# EAGLE design v2.6_Schematic (EAGLE 9.4.2)
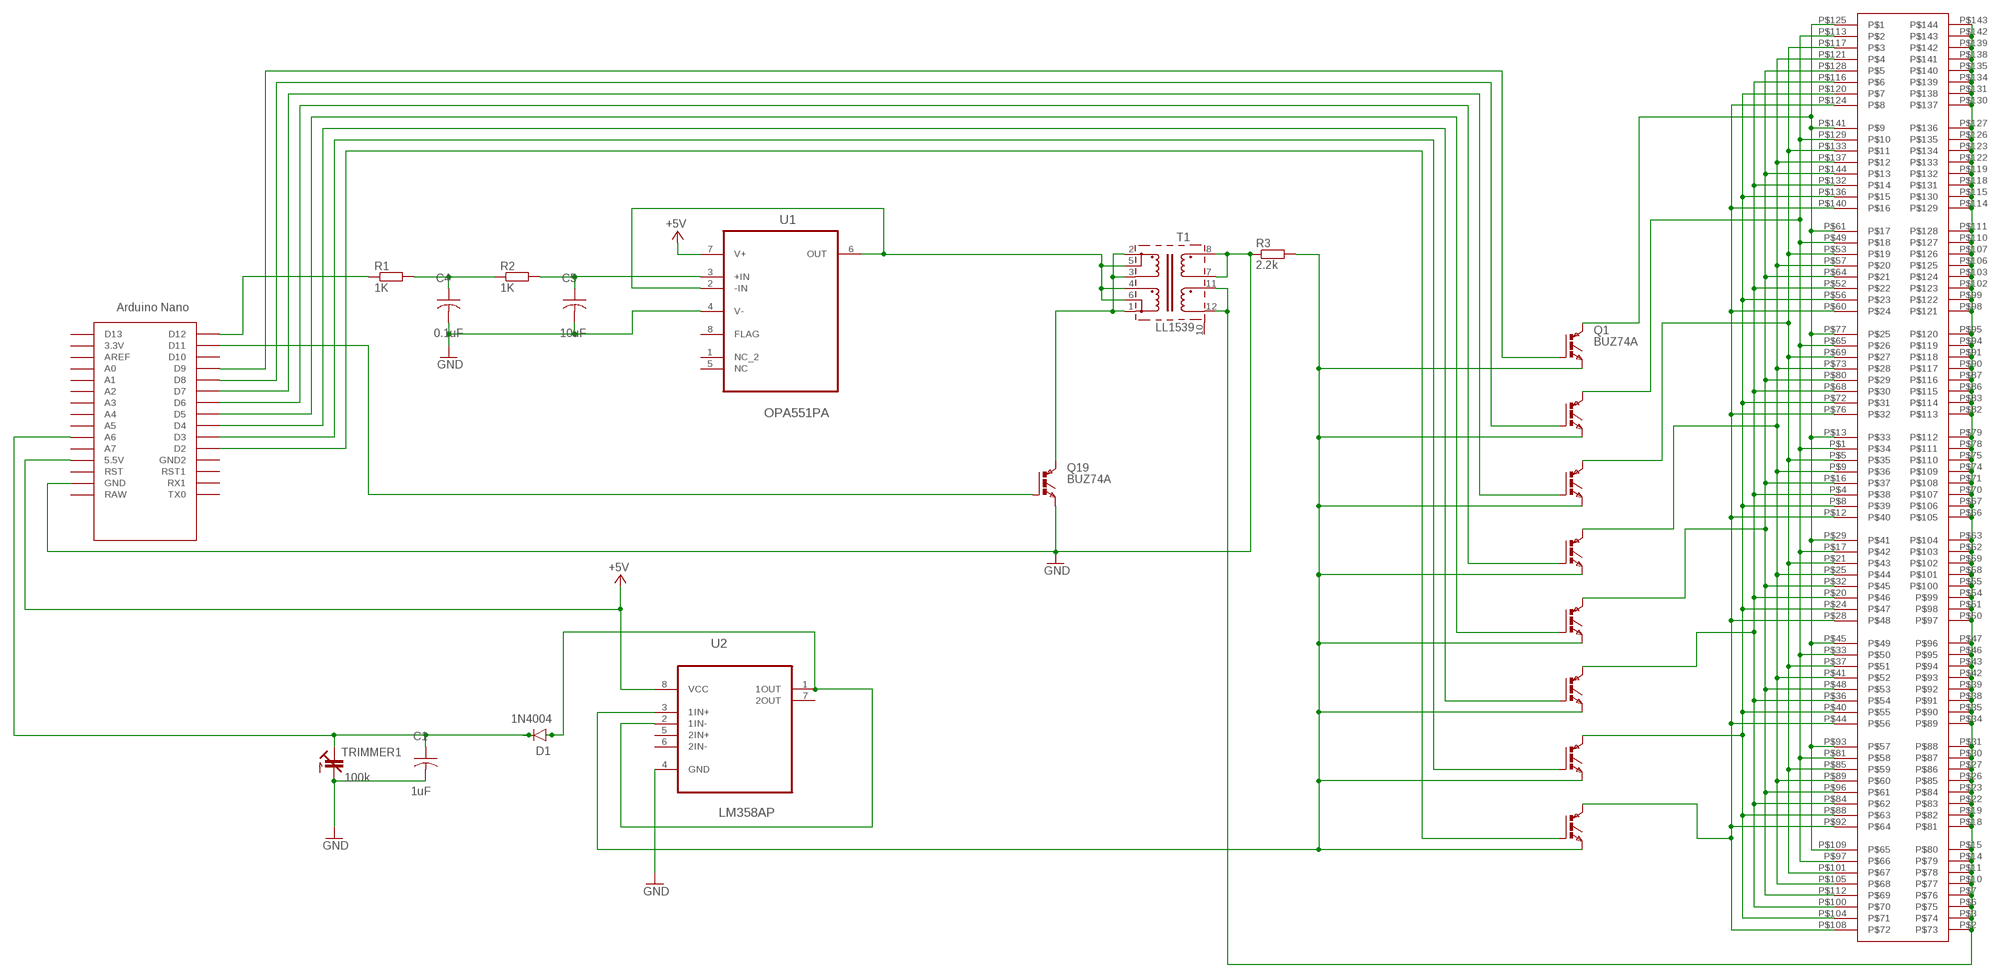
[diagram p0: schematic, sheet 1]

## Parts
C1  1uF  ECA-1HM100  [CAP_RADIAL_2MM]
C4  0.1uF  ECA-1HM100  [CAP_RADIAL_2MM]
C5  10uF  ECA-1HM100  [CAP_RADIAL_2MM]
D1  1N4004  [DO-41]
Q1  BUZ74A  IGBTTO220AV  [TO220AV]
Q2  BUZ74A  IGBTTO220AV  [TO220AV]
Q3  BUZ74A  IGBTTO220AV  [TO220AV]
Q4  BUZ74A  IGBTTO220AV  [TO220AV]
Q5  BUZ74A  IGBTTO220AV  [TO220AV]
Q6  BUZ74A  IGBTTO220AV  [TO220AV]
Q7  BUZ74A  IGBTTO220AV  [TO220AV]
Q8  BUZ74A  IGBTTO220AV  [TO220AV]
Q19  BUZ74A  IGBTTO220AV  [TO220AV]
R1  1K  R-EU_0204/2V  [0204V]
R2  1K  R-EU_0204/2V  [0204V]
R3  2.2k  R-EU_0204/2V  [0204V]
T1  LL1539  [LL1539]
TRIMMER1  100k  C-TRIMM3040.452  [CTRIM3040.452]
U1  OPA551PA  [DIP254P762X508-8]
U2  LM358AP  [DIP254P762X508-8]
U$1  NANO  [NANO]
U$2  DOTS_V2  [DOTS_V2]

## Nets
+5V: U1.7(V+) U2.8(VCC) U$1.5V(5.5V)
GND: C1.2 C4.2 C5.2 Q19.E R3.1 T1.7 T1.8 TRIMMER1.2(A) U1.4(V-) U2.4(GND) U$1.GND
N$1: T1.11 T1.12 U$2.P$2 U$2.P$3 U$2.P$6 U$2.P$7 U$2.P$10 U$2.P$11 U$2.P$14 U$2.P$15 U$2.P$18 U$2.P$19 U$2.P$22 U$2.P$23 U$2.P$26 U$2.P$27 U$2.P$30 U$2.P$31 U$2.P$34 U$2.P$35 U$2.P$38 U$2.P$39 U$2.P$42 U$2.P$43 U$2.P$46 U$2.P$47 U$2.P$50 U$2.P$51 U$2.P$54 U$2.P$55 U$2.P$58 U$2.P$59 U$2.P$62 U$2.P$63 U$2.P$66 U$2.P$67 U$2.P$70 U$2.P$71 U$2.P$74 U$2.P$75 U$2.P$78 U$2.P$79 U$2.P$82 U$2.P$83 U$2.P$86 U$2.P$87 U$2.P$90 U$2.P$91 U$2.P$94 U$2.P$95 U$2.P$98 U$2.P$99 U$2.P$102 U$2.P$103 U$2.P$106 U$2.P$107 U$2.P$110 U$2.P$111 U$2.P$114 U$2.P$115 U$2.P$118 U$2.P$119 U$2.P$122 U$2.P$123 U$2.P$126 U$2.P$127 U$2.P$130 U$2.P$131 U$2.P$134 U$2.P$135 U$2.P$138 U$2.P$139 U$2.P$142 U$2.P$143
N$2: C4.1 R1.2 R2.1
N$3: C5.1 R2.2 U1.3(+IN)
N$4: T1.4 T1.5 T1.6 U1.2(-IN) U1.6(OUT)
N$5: Q19.C T1.1 T1.2 T1.3
N$6: Q19.G U$1.D11
N$7: D1.A U2.1(1OUT) U2.2(1IN-)
N$8: C1.1 D1.C TRIMMER1.1A(E) U$1.A6
N$9: Q8.G U$1.D2
N$10: Q7.G U$1.D3
N$11: Q2.G U$1.D8
N$12: Q6.G U$1.D4
N$13: R1.1 U$1.D12
N$14: Q5.G U$1.D5
N$15: Q4.G U$1.D6
N$16: Q3.G U$1.D7
N$17: Q1.E Q2.E Q3.E Q4.E Q5.E Q6.E Q7.E Q8.E R3.2 U2.3(1IN+)
N$19: Q4.C U$2.P$9 U$2.P$25 U$2.P$41 U$2.P$57 U$2.P$73 U$2.P$89 U$2.P$105 U$2.P$121 U$2.P$137
N$20: Q1.G U$1.D9
N$21: Q2.C U$2.P$1 U$2.P$17 U$2.P$33 U$2.P$49 U$2.P$65 U$2.P$81 U$2.P$97 U$2.P$113 U$2.P$129
N$22: Q3.C U$2.P$5 U$2.P$21 U$2.P$37 U$2.P$53 U$2.P$69 U$2.P$85 U$2.P$101 U$2.P$117 U$2.P$133
N$23: Q5.C U$2.P$16 U$2.P$32 U$2.P$48 U$2.P$64 U$2.P$80 U$2.P$96 U$2.P$112 U$2.P$128 U$2.P$144
N$24: Q6.C U$2.P$4 U$2.P$20 U$2.P$36 U$2.P$52 U$2.P$68 U$2.P$84 U$2.P$100 U$2.P$116 U$2.P$132
N$25: Q7.C U$2.P$8 U$2.P$24 U$2.P$40 U$2.P$56 U$2.P$72 U$2.P$88 U$2.P$104 U$2.P$120 U$2.P$136
N$26: Q8.C U$2.P$12 U$2.P$28 U$2.P$44 U$2.P$60 U$2.P$76 U$2.P$92 U$2.P$108 U$2.P$124 U$2.P$140
N$28: Q1.C U$2.P$13 U$2.P$29 U$2.P$45 U$2.P$61 U$2.P$77 U$2.P$93 U$2.P$109 U$2.P$125 U$2.P$141
Unconnected: T1.10 U1.1(NC_2) U1.5(NC) U1.8(FLAG) U2.5(2IN+) U2.6(2IN-) U2.7(2OUT) U$1.3.3V U$1.A0 U$1.A1 U$1.A2 U$1.A3 U$1.A4 U$1.A5 U$1.A7 U$1.AREF U$1.D10 U$1.D13 U$1.GND1(GND2) U$1.RAW U$1.RST U$1.RST1 U$1.RX1 U$1.TX0

## Library data of the parts
C1 C4 C5 = Resistor_Capacitor:ECA-1HM100: CAP ALUM 10UF 20% 50V RADIAL Manufacturer's datasheet <https://media.digikey.com/pdf/Data%20Sheets/Panasonic%20Electronic%20Components/ECA-xxM%20Series,TypeA.pdf>; CREATED_BY: PCBLayout.com; DIGIKEY_PART_NUMBER: P5178-ND; MANUFACTURER: Panasonic Electronic Components; MPN: ECA-1HM100; PACKAGE: CAP RADIAL 2MM LS
D1 = Diodes:1N4004: DIODE GEN PURP 400V 1A DO41 Manufacturer's datasheet <https://www.mccsemi.com/pdf/Products/1N4001-1N4007(DO-41).pdf>; CREATED_BY: PCBLayout.com; DIGIKEY_PART_NUMBER: 1N4004MSCT-ND; MANUFACTURER: Micro Commercial Co; MPN: 1N4004; PACKAGE: DO-41
Q1-Q8 Q19 = IGBT:IGBT: IGBT
R1-R3 = resistor:R-EU_: RESISTOR, European symbol
T1 = lundahl:LL1539: LL1539 Transformer
TRIMMER1 = resistor:C-TRIMM: Trimm capacitor
U1 = Texas Instruments_By_element14_Batch_1:OPA551PA: OPERATIONAL AMPLIFIER; MPN: OPA551PA; OC_FARNELL: 4427191; OC_NEWARK: 75C5068; PACKAGE: PDIP; SUPPLIER: Texas Instruments
U2 = Texas Instruments_By_element14_Batch_1:LM358AP: OPERATIONAL AMPLIFIER; MPN: LM358AP; OC_FARNELL: 1459520; OC_NEWARK: 67K0318; PACKAGE: PDIP; SUPPLIER: Texas Instruments
U$1 = Arduino-clone:NANO: Arduino Nano
U$2 = Library:DOTS_V2

## Board
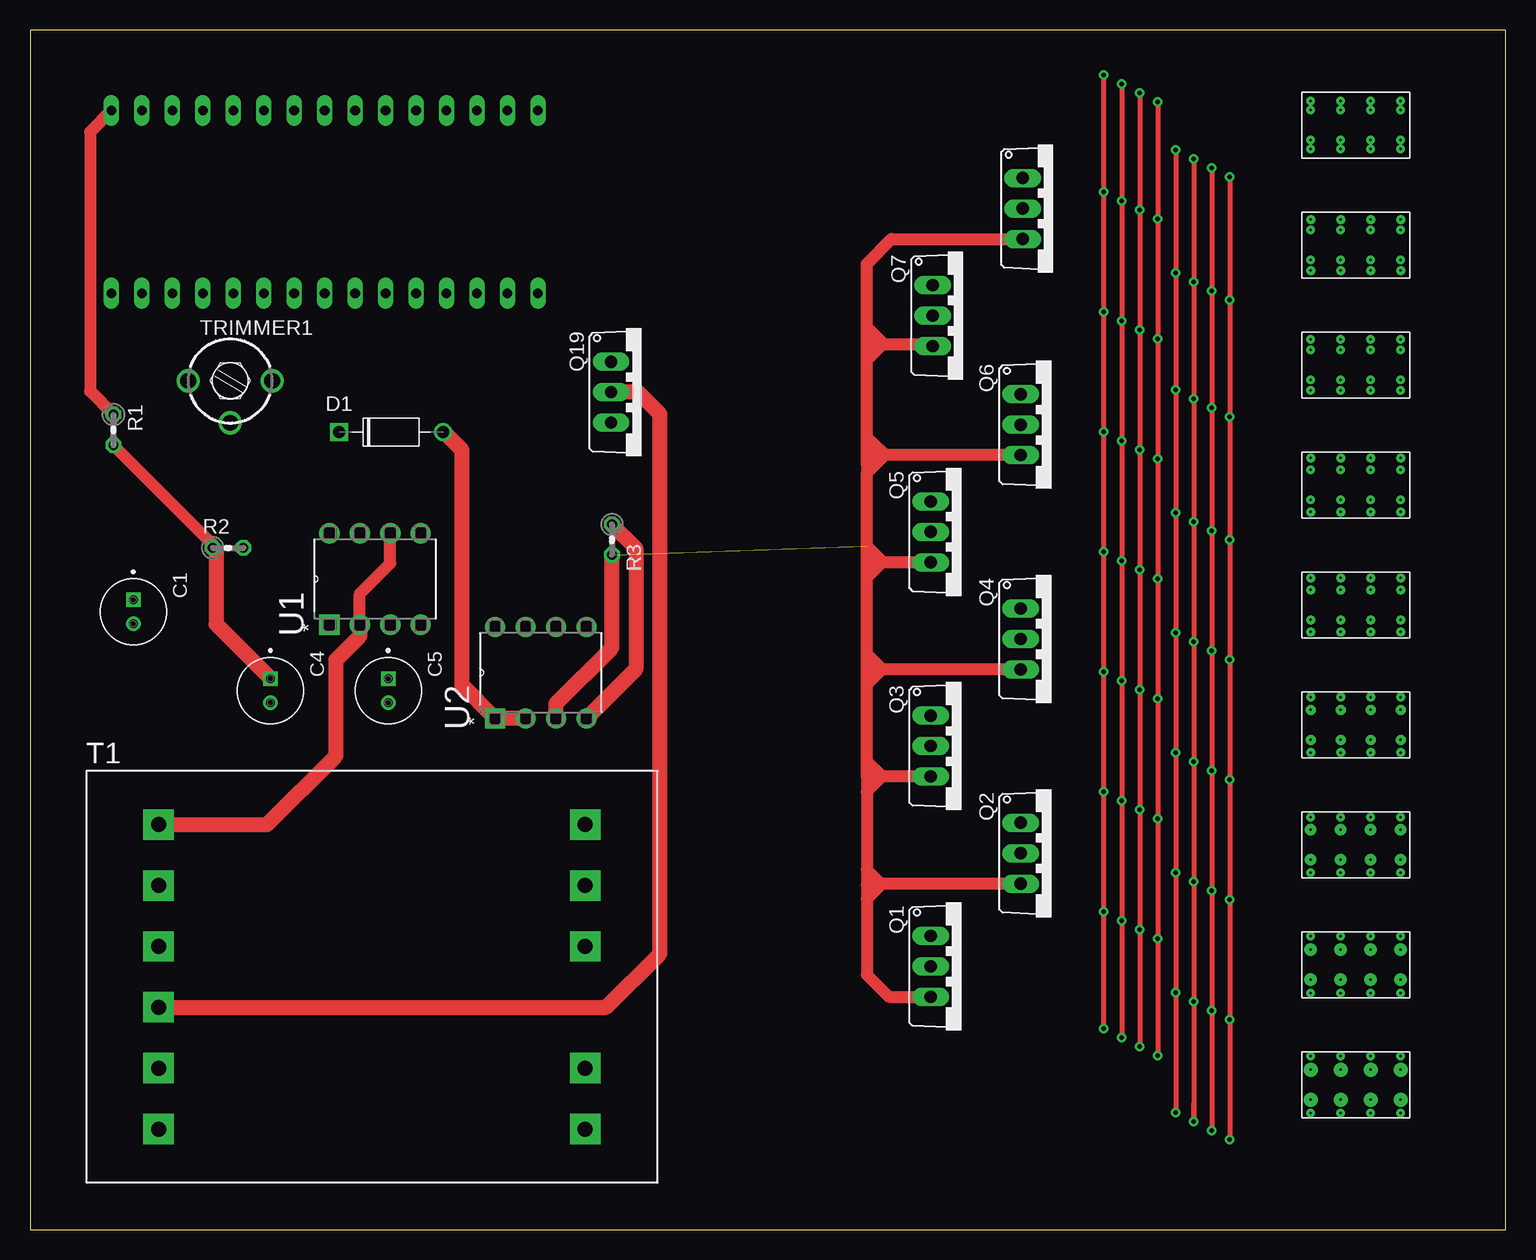
[diagram p1: board, top side]
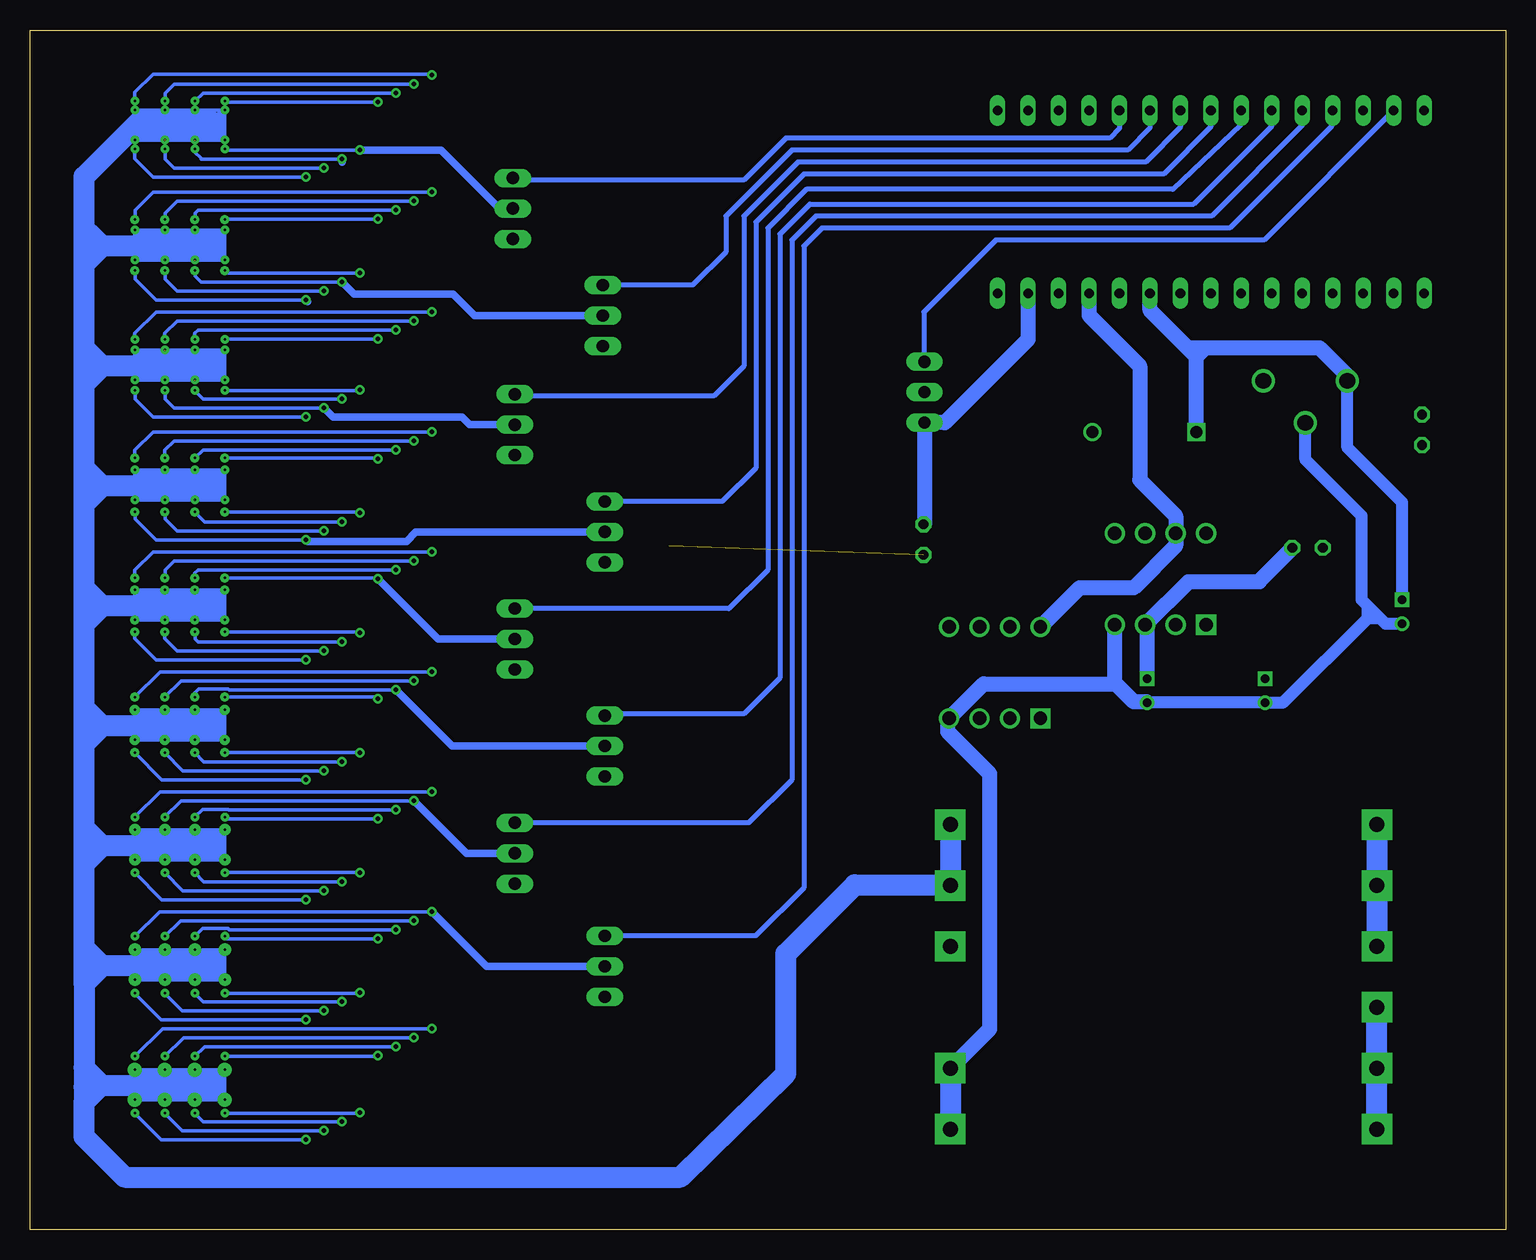
[diagram p2: board, bottom side, seen from below]

Size 123 x 100 mm. Coordinates in mm from the lower left corner, seen from the top.
Outline: 0,0 123,0 123,100 0,100 0,0
Copper layers (1*16): Top 0.035mm / dielectric 1.5mm / Bottom 0.035mm
Design rules "default": minimum track width 6mil, minimum drill 0.35mm, track to track 6mil, track to pad 6mil, pad to pad 6mil, via to via 6mil, smd to smd 6mil, copper to edge 40mil, drill to drill 6mil, minimum pad ring 10mil, minimum via ring 8mil, stop-mask expansion 4mil, vias tented up to drill 0mil, thermal gap 10mil

### Footprints (pad centres in the part's own frame; a part is rotated, then mirrored left to right if it is on the bottom)
CAP_RADIAL_2MM = drill 0.7 pad 1.1 square: 1 -1,0 | drill 0.7 pad 1.1: 2 1,0
DO-41 = drill 1: A 4.325,0 | drill 1 square: C -4.325,0
TO220AV = drill 1.016 long: C 0,-2.54; E 2.54,-2.54; G -2.54,-2.54
0204V = drill 0.813 octagon: 1 -1.27,0; 2 1.27,0
LL1539 = drill 1.27 pad 2.54 square: 1 -17.78,-12.7; 2 -17.78,-7.62; 3 -17.78,-2.54; 4 -17.78,2.54; 5 -17.78,7.62; 6 -17.78,12.7; 7 17.78,-12.7; 8 17.78,-7.62; 10 17.78,2.54; 11 17.78,7.62; 12 17.78,12.7
CTRIM3040.452 = drill 1.3: 1A -3.5,0; 1B 3.5,0; 2 0,-3.5
DIP254P762X508-8 = drill 1.118 square: 1 -7.62,7.62 | drill 1.118: 2 -7.62,5.08; 3 -7.62,2.54; 4 -7.62,0; 5 0,0; 6 0,2.54; 7 0,5.08; 8 0,7.62
NANO = drill 0.8 long: 3.3V -10.16,24.13; 5V -10.16,-1.27; A0 -10.16,19.05; A1 -10.16,16.51; A2 -10.16,13.97; A3 -10.16,11.43; A4 -10.16,8.89; A5 -10.16,6.35; A6 -10.16,3.81; A7 -10.16,1.27; AREF -10.16,21.59; D2 5.08,1.27; D3 5.08,3.81; D4 5.08,6.35; D5 5.08,8.89; D6 5.08,11.43; D7 5.08,13.97; D8 5.08,16.51; D9 5.08,19.05; D10 5.08,21.59; D11 5.08,24.13; D12 5.08,26.67; D13 -10.16,26.67; GND -10.16,-6.35; GND1 5.08,-1.27; RAW -10.16,-8.89; RST -10.16,-3.81; RST1 5.08,-3.81; RX1 5.08,-6.35; TX0 5.08,-8.89
DOTS_V2 = drill 0.2 pad 0.75: P$1 -2.25,1.25; P$2 -1.25,1.25; P$3 1.25,1.25; P$4 2.25,1.25; P$5 -2.25,-1.25; P$6 -1.25,-1.25; P$7 1.25,-1.25; P$8 2.25,-1.25; P$9 -2.25,-3.75; P$10 -1.25,-3.75; P$11 1.25,-3.75; P$12 2.25,-3.75; P$13 -2.25,3.75; P$14 -1.25,3.75; P$15 1.25,3.75; P$16 2.25,3.75; P$17 7.688,1.25; P$20 12.312,1.25; P$21 7.688,-1.25; P$24 12.312,-1.25; P$25 7.688,-3.75; P$28 12.312,-3.75; P$29 7.688,3.75; P$32 12.312,3.75; P$65 -12.25,1.25; P$68 -7.75,1.25; P$69 -12.25,-1.25; P$72 -7.75,-1.25; P$73 -12.25,-3.75; P$76 -7.75,-3.75; P$77 -12.25,3.75; P$80 -7.75,3.75; P$129 -32.125,1.25; P$132 -27.875,1.25; P$133 -32.125,-1.25; P$136 -27.875,-1.25; P$137 -32.125,-3.75; P$140 -27.875,-3.75; P$141 -32.125,3.75; P$144 -27.875,3.75 | drill 0.2 pad 0.85: P$18 8.75,1.25; P$19 11.25,1.25; P$22 8.75,-1.25; P$23 11.25,-1.25; P$26 8.75,-3.75; P$27 11.25,-3.75; P$30 8.75,3.75; P$31 11.25,3.75 | drill 0.2 pad 0.65: P$33 17.688,1.25; P$36 22.312,1.25; P$37 17.688,-1.25; P$40 22.312,-1.25; P$41 17.688,-3.75; P$44 22.312,-3.75; P$45 17.688,3.75; P$48 22.312,3.75; P$66 -11.25,1.25; P$67 -8.75,1.25; P$70 -11.25,-1.25; P$71 -8.75,-1.25; P$74 -11.25,-3.75; P$75 -8.75,-3.75; P$78 -11.25,3.75; P$79 -8.75,3.75; P$113 -42,1.25; P$116 -38,1.25; P$117 -42,-1.25; P$120 -38,-1.25; P$121 -42,-3.75; P$124 -38,-3.75; P$125 -42,3.75; P$128 -38,3.75 | drill 0.2 pad 0.95: P$34 18.75,1.25; P$35 21.25,1.25; P$38 18.75,-1.25; P$39 21.25,-1.25; P$42 18.75,-3.75; P$43 21.25,-3.75; P$46 18.75,3.75; P$47 21.25,3.75 | drill 0.2 pad 0.7: P$49 -22.125,1.25; P$52 -17.875,1.25; P$53 -22.125,-1.25; P$56 -17.875,-1.25; P$57 -22.125,-3.75; P$60 -17.875,-3.75; P$61 -22.125,3.75; P$64 -17.875,3.75 | drill 0.2 pad 0.55: P$50 -21.25,1.25; P$51 -18.75,1.25; P$54 -21.25,-1.25; P$55 -18.75,-1.25; P$58 -21.25,-3.75; P$59 -18.75,-3.75; P$62 -21.25,3.75; P$63 -18.75,3.75; P$97 37.625,1.25; P$100 42.375,1.25; P$101 37.625,-1.25; P$104 42.375,-1.25; P$105 37.625,-3.75; P$108 42.375,-3.75; P$109 37.625,3.75; P$112 42.375,3.75 | drill 0.2 pad 0.6: P$81 27.625,1.25; P$84 32.375,1.25; P$85 27.625,-1.25; P$88 32.375,-1.25; P$89 27.625,-3.75; P$92 32.375,-3.75; P$93 27.625,3.75; P$96 32.375,3.75 | drill 0.2 pad 1.05: P$82 28.75,1.25; P$83 31.25,1.25; P$86 28.75,-1.25; P$87 31.25,-1.25; P$90 28.75,-3.75; P$91 31.25,-3.75; P$94 28.75,3.75; P$95 31.25,3.75 | drill 0.2 pad 1.15: P$98 38.75,1.25; P$99 41.25,1.25; P$102 38.75,-1.25; P$103 41.25,-1.25; P$106 38.75,-3.75; P$107 41.25,-3.75; P$110 38.75,3.75; P$111 41.25,3.75 | drill 0.2 pad 0.35: P$114 -41.25,1.25; P$115 -38.75,1.25; P$118 -41.25,-1.25; P$119 -38.75,-1.25; P$122 -41.25,-3.75; P$123 -38.75,-3.75; P$126 -41.25,3.75; P$127 -38.75,3.75 | drill 0.2 pad 0.45: P$130 -31.25,1.25; P$131 -28.75,1.25; P$134 -31.25,-1.25; P$135 -28.75,-1.25; P$138 -31.25,-3.75; P$139 -28.75,-3.75; P$142 -31.25,3.75; P$143 -28.75,3.75

### Placement (x,y rotation side)
C1  8.61,51.5 270 top
C4  20.05,44.93 270 top
C5  29.86,44.92 270 top
D1  30.1,66.47 0 top
Q1  77.63,21.94 270 top
Q2  85.13,31.37 270 top
Q3  77.63,40.3 270 top
Q4  85.13,49.23 270 top
Q5  77.63,58.16 270 top
Q6  85.13,67.09 270 top
Q7  77.79,76.19 270 top
Q8  85.29,85.12 270 top
Q19  50.98,69.8 270 top
R1  6.95,66.67 270 top
R2  16.51,56.83 0 top
R3  48.52,57.51 270 top
T1  28.5,21.07 0 top
TRIMMER1  16.69,70.75 0 top
U1  32.58,58.04 90 top
U2  46.39,50.23 90 top
U$1  33.45,88.22 90 top
U$2  110.51,52.07 270 top

### Tracks (layer width: path | path; a pad name or v marks a point on that pad's centre or on a via)
+5V
  Bottom 1.27: U2.8 35.5,53.5 31,53.5 27.5,57 U1.7 27.5,59.5 30.5,62.5 30.5,72 34.72,76.22 U$1.5V
GND
  Top 1.27: R3.1 50.5,56.8 50.5,46.73 U2.4
  Bottom 1.016: C1.2 10,50.5 10.5,51 | 10.5,51 11,51.5 | 11,51.5 11.5,52 | 11.5,52 12,52.5 12,59.5 16.69,64.19 TRIMMER1.2 | 11.5,51 18.57,43.93 C4.2 C5.2 | 11.5,51 11,51.5 | 11.5,51 10.5,51 | 11.5,51 11.5,52
  Bottom 1.27: U$1.GND 39.81,74.19 46.74,67.26 Q19.E 48.44,58.86 R3.1 | C5.2 29.94,44 31,44 32.58,45.58 | 32.58,45.58 U1.4 | 32.58,45.58 32.66,45.5 43.5,45.5 U2.4 46.5,42.51 46.5,41.5 43,38 43,16.73 T1.8
  Bottom 1.75: T1.8 T1.7
N$1  (7 unrouted)
  Bottom 0.152: U$2.P$22 U$2.P$18 | U$2.P$31 U$2.P$19 U$2.P$23 U$2.P$27 | U$2.P$15 U$2.P$3 U$2.P$7 U$2.P$11 | U$2.P$6 U$2.P$2 113.5,53.32 | 107.5,63.32 U$2.P$70 U$2.P$66 | U$2.P$71 U$2.P$67 U$2.P$79 | 114,70.82 U$2.P$63 | 107.5,83.32 U$2.P$134 U$2.P$130 113.25,83.32 | 114,90.82 U$2.P$127
  Bottom 0.305: 106.76,92 U$2.P$122 U$2.P$126 114.26,92 | 106.76,92 106.76,90.88 U$2.P$123 U$2.P$119 U$2.P$115 114,90.82 | 106.76,82.5 U$2.P$138 107.5,83.32 | 106.76,82.5 106.76,82 | 106.76,82 U$2.P$139 U$2.P$135 U$2.P$131 U$2.P$143 114.26,82 | 113.5,83.32 U$2.P$142 114.26,82.56 | 113.5,83.32 113.25,83.32 | 113.25,83.32 107.5,83.32 | 114,70.82 U$2.P$55 U$2.P$59 106.76,72 | 106.76,72 106.76,72.5 | 106.76,72.5 U$2.P$58 107.58,73.32 | 114.26,92 U$2.P$127 | 114.26,72.81 U$2.P$62 113.75,73.32 | 114.26,72 114.26,72.5 | 114.26,72 U$2.P$63 | 113.75,73.32 113.5,73.32 | 113.5,73.32 U$2.P$50 107.58,73.32 | 106.76,62 106.76,63.25 U$2.P$74 107.5,63.32 | 106.76,62 U$2.P$75 U$2.P$71 U$2.P$79 114.26,62 | 113.75,63.32 U$2.P$78 114.26,62.75 | 113.75,63.32 113.5,63.32 | 113.5,63.32 U$2.P$66 107.5,63.32 | 114.26,62.75 114.26,62 | 106.76,52.75 U$2.P$10 107.5,53.32 | 106.76,52.75 106.76,52.5 | 106.76,52.5 106.76,52 | 106.76,52 U$2.P$11 U$2.P$3 U$2.P$15 114.26,52 | 113.75,53.32 U$2.P$14 114.26,52 | 113.75,53.32 113.5,53.32 | 113.5,53.32 U$2.P$6 107.5,53.32 | 106.76,42.75 U$2.P$26 107.5,43.32 | 106.76,42.75 106.76,42 | 106.76,42 U$2.P$27 U$2.P$31 114.26,42 | 107.5,43.32 U$2.P$22 U$2.P$18 113.5,43.32 | 113.5,43.32 113.75,43.32 | 113.75,43.32 U$2.P$30 114.26,42.75 | 114.26,42.75 114.26,42 | 106.76,32 U$2.P$42 U$2.P$34 U$2.P$46 114.26,32 | 106.76,32 U$2.P$43 U$2.P$47 114.26,32 | 114.26,22 U$2.P$94 U$2.P$90 106.76,22 | 114.26,22 U$2.P$95 U$2.P$91 106.76,22 | U$2.P$106 106.76,12 | 106.76,11.5 U$2.P$107 107,10.82 | 106.76,11.5 106.76,12 | 107,10.82 107.43,10.82 | 107.43,10.82 113.5,10.82 | U$2.P$111 114.26,11.5 | 114.26,11.5 114.26,12 | 114.26,12 114.26,12.5 | 114.26,12.5 114.26,12.75
  Bottom 0.305: 114.26,12.75 U$2.P$110 | 107.68,13.32 113.44,13.32 | 113.69,13.32 U$2.P$110 | 106.76,12 107,12 | 107,12 108,12 107.5,11.5 107.12,11.12 | 106.76,22 107,22 108,22 | 113,22 114,22 114.26,22 | 106.76,32 108,32 | 113,32 113.25,32 114.26,32 | 106.76,42 108,42 | 113.51,42 114.26,42 | 106.76,52 107.5,52 107.51,52 | 114,52 113.5,52 113,52 113.5,52.5 | 114,52 114.26,52 | 106.76,62 107.25,62 107.5,62 108,62 | 114.26,62 114,62 113.5,62 113,62 113.5,62.5 | 106.76,72 107.5,72 108,72 | 113.76,72 114.26,72 | 106.76,82 108,82 | 114.26,82 113,82 113.25,82.25 113.25,83.32 | 106.76,92 108,92 | 113,92 114.26,92 | U$2.P$106 107,13.08 107,12 | 107.68,13.32 108,13 107.57,13 | U$2.P$106 107,13.32 | 107,13.32 107.25,13.32 | 107.25,13.32 107.68,13.32 | U$2.P$106 107.08,13 107.32,13 | 107.57,13 107.25,13.32 | 107.57,13 107.32,13 | 107.32,13 107,13.32 | 107.12,11.12 107,11 | 107,11 107,10.82 | 106.76,11.5 107,11.26 107,11 | 107.43,10.82 107.12,11.12 | 113.44,13.32 113.69,13.32 | 113.69,13.32 114,13.01 | 114,13.01 114.26,12.75 | 113.44,13.32 114.26,12.5 | U$2.P$110 114.26,13.26 114,13.01 | 113,12 113.88,12 114.26,12 | 113.5,10.82 113.72,11.04 | 113.72,11.04 113.97,11.29 | 113.97,11.29 114.18,11.5 114.26,11.5 | U$2.P$111 113.97,11.12 113.97,11.29 | U$2.P$111 113.5,10.82 | U$2.P$111 113.93,10.82 113.72,11.04 | 113.5,42.5 113.5,43.32 | 113.75,43.32 113.75,42.75 113,42 113.51,42 | 113.51,42 114.26,42.75 | 107.5,42.58 106.93,42.58 106.76,42.75 | 107.16,42.91 107.16,42.98 107.5,43.32 | 107.5,53.32 107.5,52.5 108,52 107.51,52 | 107.29,52.79 107,52.5 106.76,52.5 | 107.51,52 106.76,52.75 | 113.75,52.75 113.84,52.84 113.84,52.91 114,52.75 114,52 | 113.5,52.5 113.5,53.32 | 113.5,52.5 113.75,52.75
  Bottom 0.305: 113.75,52.75 113.75,53.32 | 107.5,62.75 107.5,63.32 | 113.69,62.75 113.5,62.94 | 113.5,62.94 113.5,63.32 | 113.72,62.78 114.23,62.78 114.26,62.75 | 113.5,62.5 113.5,62.94 | 113.5,62.5 113.75,62.75 113.75,63.32 | 106.76,72.5 107.58,73.32 | 113.5,72.5 113,72 113.51,72 | 113.5,72.5 113.5,73.32 | 114.26,72.5 114.26,72.75 | 114.26,72.75 114.26,72.81 | 114.26,72.81 113.78,73.28 | 113.78,73.28 113.75,73.32 | 113.51,72 113.76,72 | 113.76,72 114.26,72.5 | 113.51,72 114.26,72.75 | 113.5,72.5 113.78,72.78 113.78,73.28 | 106.76,82.5 107.5,83.24 107.5,83.32 | 114.26,82 114.26,82.56 | 114.26,82.56 113.5,83.32
  Bottom 0.61: 108,23 107.08,23 U$2.P$90 107,23.08 107,22 | U$2.P$86 109,23.06 109,22 109,21.08 U$2.P$87 | U$2.P$82 112,23.08 112,23 113.94,23 U$2.P$94 114.26,23.26 113,22 112.94,22 U$2.P$83 | U$2.P$95 114,21.08 114,22 | U$2.P$91 107.94,22 108,22 | U$2.P$106 108,12.08 108,12.06 | U$2.P$102 108,12.06 | 108,12.06 108,12 | U$2.P$103 109,11.08 109,12 | U$2.P$99 112.94,12 113,12 | U$2.P$111 113.08,12 113,12 | U$2.P$110 113,12.06 | 113,12.06 113,12 | U$2.P$107 107.44,11.5 107.5,11.5 | U$2.P$98 113,12.08 113,12.06 | 107.16,32.91 U$2.P$42 | 109.26,32.74 109.09,32.91 107.16,32.91 | 109.26,31.26 109.25,31.25 107.19,31.25 U$2.P$43 | 107.16,32.91 107.16,32.84 108,32 | U$2.P$46 113.84,32.91 | 113.84,32.91 113.25,32.31 | 113.25,32.31 113.25,32 | 113.84,32.84 113.84,32.91 | 113,32 113.84,32.84 | 111.5,32 112.34,32.84 113.25,32.84 | 113.25,32.84 113.84,32.84 | 110,32 110.43,32 U$2.P$34 | U$2.P$35 113.25,32.31 | 113.25,32.31 113.25,32.84 | U$2.P$34 112.18,32.91 113.84,32.91 | U$2.P$47 113.84,31.23 113.84,32.84 | U$2.P$38 109.26,32.74 | 109.26,32.74 110,32 | U$2.P$39 109.26,31.26 | 109.26,31.26 110,32 | U$2.P$26 107.16,42.91 107.5,42.58 107.5,41.5 106.82,40.82 U$2.P$27 | U$2.P$23 U$2.P$22 | U$2.P$19 U$2.P$18 | U$2.P$30 114.26,43.26 113.5,42.5 | 113.5,42.5 113.5,41.58 U$2.P$31 | 113,42 113.5,42.5 | U$2.P$138 107.25,82.83 107.25,81.31 U$2.P$139 | U$2.P$142 113.44,82.5 113.25,82.5 113.25,81.83 U$2.P$143 | U$2.P$58 107.5,72.58 107.5,72 107.5,71.56 U$2.P$59 | U$2.P$63 113.08,72 113,72 | 113.25,72.5 113.44,72.5 U$2.P$62 | U$2.P$79 113.5,61.58 113.5,62 | U$2.P$78 113.72,62.78 113.69,62.75 107.5,62.75 107.26,62.75 106.76,63.25 | U$2.P$74 107.25,62.83 107.25,62
  Bottom 0.61: U$2.P$75 107.5,61.56 107.5,62 | U$2.P$11 107.5,51.56 107.5,52 | U$2.P$15 113.5,51.58 113.5,52 | 113.84,52.91 U$2.P$14 | U$2.P$10 107.29,52.79 108,52.08 108,52 | U$2.P$122 107.58,92.5 107.75,92.5 107.75,91.81 106.82,90.88 106.76,90.88 | U$2.P$118 U$2.P$119 | U$2.P$114 U$2.P$115 | U$2.P$126 113.69,92.75 113.5,92.75 113.5,92.5 113.5,91.57 114.19,90.88 114.25,90.88 | U$2.P$134 U$2.P$135 | U$2.P$130 U$2.P$131 | U$2.P$54 U$2.P$55 | U$2.P$51 U$2.P$50 | U$2.P$70 U$2.P$71 | U$2.P$67 U$2.P$66 | U$2.P$7 U$2.P$6 | U$2.P$2 U$2.P$3
  Bottom 1.75: 118.5,20.5 118.5,13.5 | 118.5,13.5 118.5,11.88 | 118.5,20.5 118.5,22 | 118.5,22 118.5,23.5 | 118.5,23.5 118.5,30.5 | 118.5,30.5 118.5,32.5 | 118.5,32.5 118.5,33.5 | 118.5,33.5 118.5,40.5 | 118.5,40.5 118.5,42 | 118.5,42 118.5,43.5 | 118.5,43.5 118.5,50.5 | 118.5,50.5 118.5,52 | 118.5,52 118.5,53.5 | 118.5,53.5 118.5,60.5 | 118.5,60.5 118.5,62 | 114,22 117,22 | 118.5,22 117,22 | 114.26,32 117,32 | 117,32 118,32 118.5,32.5 | 113,42 117,42 | 118.5,42 117,42 | 114.26,52 117,52 | 118.5,52 117,52 | 114,62 117,62 | 118.5,62 117,62 | 113,72 117,72 | 118,72 117,72 | 113.5,92.5 113.78,92.5 118.5,87.78 118.5,82.5 | 118.5,62 118.5,63.5 | 118.5,63.5 118.5,70.5 | 118.5,70.5 118.5,73.5 | 118.5,73.5 118.5,80.5 | 118.5,80.5 118.5,82.5 | 114.26,82 117,82 | 118,82 117,82 | 117,22 118.5,23.5 | 117,22 118.5,20.5 | 117,32 118.5,33.5 | 117,32 118.5,30.5 | 117,42 118.5,43.5 | 117,42 118.5,40.5 | 117,52 118.5,53.5 | 117,52 118.5,50.5 | 117,62 118.5,63.5 | 117,62 118.5,60.5 | 117,72 118.5,73.5 | 117,72 118.5,70.5 | 117,82 118,83 118.5,82.5 | 117,82 118.5,80.5 | 118.5,11.88 118.5,10.62 | 118.5,10.62 118.5,7.75 115.12,4.38 68.78,4.38 60,13 60,23 54.25,28.75 46.34,28.75 T1.11 T1.12 | 113.88,12 117,12 | 117.12,12 118.38,12 118.5,11.88 | 118.5,13.5 117,12 | 117,12 117.12,12 | 117.12,12 118.5,10.62
  Bottom 2.54: 108,12 109,12 113,12 | 108,22 109,22 113,22 | 113,32 111.5,32 110,32 108,32 | 108,42 113,42 | 108,52 113,52 | 108,62 113,62 | 108,72 113,72 | 108,82 113,82 | 108,92 113,92
N$2
  Top 1.016: R1.2 15.23,57.12 R2.1
  Top 1.27: R2.1 15.5,56.56 15.5,50.48 C4.1
N$3
  Bottom 1.27: R2.2 20.5,54.1 20.5,54 26.45,54 U1.3 29.86,50.24 C5.1
N$4
  Top 1.016: U1.2 27.5,53 30.04,55.54 U1.6
  Top 1.27: T1.6 19.77,33.77 25.5,39.5 25.5,47.5 27.5,49.5 U1.2
  Bottom 1.27: 10.72,29 T1.4
  Bottom 1.75: T1.6 10.72,29 | T1.5 T1.4
N$5
  Top 1.27: T1.3 48.03,18.52 52.5,23 52.5,68 50.7,69.8 Q19.C
  Bottom 1.27: 10.72,13 10.72,18 T1.3
  Bottom 1.75: T1.1 10.72,13 | T1.2 10.72,18
N$6
  Bottom 0.406: U$1.D11 20.12,82.5 42.5,82.5 48.5,76.5 48.5,72.4 Q19.G
N$7
  Top 1.27: U2.2 U2.1 36,45.38 36,65 34.53,66.47 D1.A
N$8
  Bottom 1.016: C1.1 8.61,60.61 13.19,65.19 TRIMMER1.1A
  Bottom 1.27: D1.C 25.77,72.78 | U$1.A6 29.65,76.64 26.5,73.5 | 25.77,72.78 26.5,73.5 | 25.77,72.78 25.05,73.5 | 25.05,73.5 15.5,73.5 13.19,71.19 TRIMMER1.1A | 25.05,73.5 26.5,73.5
N$9
  Bottom 0.406: U$1.D2 32.19,91.81 33,91 60,91 63.5,87.5 82.59,87.5 Q8.G
N$10
  Bottom 0.406: U$1.D3 29.65,91.86 31.5,90 59.5,90 65,84.5 65,81.5 67.77,78.73 Q7.G
N$11
  Bottom 0.406: U$1.D8 16.95,92.06 24.5,84.5 57.5,84.5 59.5,82.5 59.5,37.5 63.09,33.91 Q2.G
N$12
  Bottom 0.406: U$1.D4 27.1,91.89 30,89 59,89 63.5,84.5 63.5,72 66,69.5 82.46,69.5 Q6.G
N$13
  Top 1.016: U$1.D12 5,91.51 5,69.89 R1.1
N$14
  Bottom 0.406: U$1.D5 24.56,91.94 28.5,88 58.5,88 62.5,84 62.5,63.5 65.3,60.7 Q5.G
N$15
  Bottom 0.406: Q4.G 64.73,51.77 61.5,55 61.5,83.5 58.28,86.72 27.74,86.72 22.02,92.16 U$1.D6
N$16
  Bottom 0.406: U$1.D7 19.5,93.28 19.5,92 26,85.5 58,85.5 60.5,83 60.5,46 63.5,43 74.93,43 Q3.G
N$17  (1 unrouted)
  Top 1.016: 70.08,73.83 70.75,73.83 | Q6.E 71.25,64.55 | 70.5,64.55 71.25,64.55 | 69.95,64.55 70.5,64.55 | Q5.E 71,55.62 | 69.88,55.62 71,55.62 | Q4.E 71,46.69 | 69.81,46.69 71,46.69 | 69.75,37.75 69.75,39 | 69.75,39 69.75,45.5 | 69.75,45.5 69.75,48 | 69.75,48 69.75,54.5 | 69.75,54.5 69.75,57 | 69.75,57 69.75,63.05 | 69.75,63.8 69.75,65.75 | 69.75,65.75 69.75,72.5 | 69.75,72.5 69.75,74.83 | 69.75,74.83 69.75,75.25 | 69.75,75.25 69.75,80.5 71.83,82.58 Q8.E | 69.75,37.75 69.75,36.51 | 69.75,36.51 69.75,30 | 69.75,30 69.75,28.75 | 69.75,28.75 69.75,27.58 | 69.75,27.58 69.75,21.25 71.6,19.4 Q1.E | Q2.E 71,28.83 | 70.92,28.83 69.83,28.83 69.75,28.75 | Q3.E 71,37.76 | 71,37.76 69.76,37.76 69.75,37.75 | 71,28.83 69.75,27.58 | 71,28.83 70.92,28.83 | 70.92,28.83 69.75,30 | 71,37.76 69.75,36.51 | 71,37.76 69.76,39 69.75,39 | 71,46.69 69.81,45.5 69.75,45.5 | 71,46.69 71,46.75 69.75,48 | 71,55.62 69.88,54.5 69.75,54.5 | 71,55.62 71,55.75 69.75,57 | 70.5,64.55 69.75,63.8 | 69.75,63.8 69.75,63.05 | 71.25,64.55 69.75,63.05 | 71.25,64.55 70.05,65.75 69.75,65.75 | 70.75,73.83 69.75,74.83 | 70.75,73.83 70.75,74.25 | 70.75,74.25 69.75,75.25 | 70.75,73.83 71.08,73.83 | 71.17,73.83 70.75,74.25 | 70.75,73.83 70.75,73.5 | 70.75,73.5 69.75,72.5 | 71.17,73.83 71.08,73.83 | 71.08,73.83 70.75,73.5 | 71.17,73.83 75.07,73.83 Q7.E
  Top 1.27: U2.3 43.85,43.85 48.5,48.5 48.5,56.23 R3.2
N$19  (via drill 0.35 pad 0.55)
  Top 0.406: v94,94 v94,84.25 v94,74.25 v94,64.25 v94,54.25 v94,44.25 v94,34.25 v94,24.25 v94,14.5
  Bottom 0.305: U$2.P$121 106.69,94 v94,94 | U$2.P$137 106.56,84.19 106.5,84.25 v94,84.25 | U$2.P$57 106.71,74.25 v94,74.25 | U$2.P$73 94.07,64.32 v94,64.25 | U$2.P$9 94.07,54.32 v94,54.25 | U$2.P$25 94.13,44.38 v94,44.25 | U$2.P$41 106.63,34.25 v94,34.25 | U$2.P$89 106.56,24.25 v94,24.25 | U$2.P$105 94.06,14.45 v94,14.5
  Bottom 0.61: Q4.C 88.98,49.23 v94,54.25
N$20
  Bottom 0.406: U$1.D9 14.5,93.2 14.5,92 23,83.5 57,83.5 58.5,82 58.5,28.5 62.52,24.48 Q1.G
N$21  (via drill 0.35 pad 0.55)
  Top 0.406: v91,95.5 v91,85.75 v91,75.75 v91,65.75 v91,55.75 v91,45.75 v91,35.75 v91,25.75 v91,16
  Bottom 0.305: U$2.P$113 111.75,94.75 111,95.5 v91,95.5 | U$2.P$129 111.75,84.2 111.75,84.75 110.75,85.75 v91,85.75 | U$2.P$49 111.76,74.74 110.75,75.75 v91,75.75 | U$2.P$65 111.76,64.99 111,65.75 v91,65.75 | U$2.P$1 111.75,55 111,55.75 v91,55.75 | U$2.P$17 110.39,45.75 v91,45.75 | U$2.P$33 110.39,35.75 v91,35.75 | U$2.P$81 110.46,25.75 v91,25.75 | U$2.P$97 110.21,16 v91,16
  Bottom 0.61: v91,35.75 86.62,31.37 Q2.C
N$22  (via drill 0.35 pad 0.55)
  Top 0.406: v92.5,94.75 v92.5,85 v92.5,75 v92.5,65 v92.5,55 v92.5,45 v92.5,35 v92.5,25 v92.5,15.25
  Bottom 0.305: U$2.P$117 108.58,94.75 v92.5,94.75 | U$2.P$133 109.25,84.2 109.25,84.75 109,85 v92.5,85 | U$2.P$53 109.26,74.74 109,75 v92.5,75 | U$2.P$69 108.58,65 v92.5,65 | U$2.P$5 109.26,54.74 109,55 v92.5,55 | U$2.P$21 109.26,44.74 108.94,45.06 106.48,45.06 106.42,45 v92.5,45 | v92.5,35 106.45,35 106.49,35.04 108.6,35.04 U$2.P$37 | v92.5,25 106.38,25 106.49,25.1 108.6,25.1 U$2.P$85 | U$2.P$101 108.46,15.25 v92.5,15.25
  Bottom 0.61: Q3.C 87.8,40.3 v92.5,45
N$23  (via drill 0.35 pad 0.55)
  Top 0.406: v100,87.75 v100,77.5 v100,67.75 v100,57.5 v100,47.5 v100,37.5 v100,27.5 v100,17.5 v100,7.5
  Bottom 0.305: U$2.P$128 114.26,89.26 112.75,87.75 v100,87.75 | U$2.P$144 114.25,79.25 112.5,77.5 v100,77.5 | U$2.P$64 114.25,69.25 112.75,67.75 v100,67.75 | U$2.P$80 114.25,59.25 112.5,57.5 v100,57.5 | U$2.P$16 114.26,49.26 112.5,47.5 v100,47.5 | U$2.P$32 112,37.5 v100,37.5 | U$2.P$112 112.06,7.5 v100,7.5 | U$2.P$48 112,27.5 v100,27.5 | U$2.P$96 112.06,17.5 v100,17.5
  Bottom 0.61: 99.84,77.33 v100,77.5 | Q5.C 90.84,58.16 91.62,57.38 99.88,57.38 v100,57.5
N$24  (via drill 0.35 pad 0.55)
  Top 0.406: v98.5,88.5 v98.5,78.25 v98.5,68.5 v98.5,58.25 v98.5,48.25 v98.5,38.25 v98.5,28.25 v98.5,18.25 v98.5,8.25
  Bottom 0.305: U$2.P$116 111.75,89.25 111,88.5 v98.5,88.5 | U$2.P$132 111.75,79.25 110.75,78.25 v98.5,78.25 | U$2.P$52 111.75,69.25 111,68.5 v98.5,68.5 | U$2.P$68 111.75,59.25 110.75,58.25 v98.5,58.25 | U$2.P$4 111.76,49.26 110.75,48.25 v98.5,48.25 | U$2.P$20 110.25,38.25 v98.5,38.25 | U$2.P$100 110.31,8.25 v98.5,8.25 | U$2.P$36 110.25,28.25 v98.5,28.25 | U$2.P$84 110.31,18.25 v98.5,18.25
  Bottom 0.61: Q6.C 86.34,67.09 87,67.75 97.75,67.75 v98.5,68.5
N$25  (via drill 0.35 pad 0.55)
  Top 0.406: v97,89.25 v97,79 v97,69.25 v97,59 v97,49 v97,39 v97,29 v97,19 v97,9 97,10.5
  Bottom 0.305: U$2.P$120 109.26,89.82 108.75,89.31 108.75,89.25 v97,89.25 | U$2.P$136 109.25,79.5 108.75,79 v97,79 | U$2.P$56 108.56,69.25 v97,69.25 | U$2.P$72 108.44,59 v97,59 | U$2.P$8 109.25,49.25 109,49 v97,49 | U$2.P$24 108.5,39 v97,39 | U$2.P$104 108.56,9 v97,9 | U$2.P$40 108.5,29 v97,29 | U$2.P$88 108.56,19 v97,19
  Bottom 0.61: 97,89 v97,89.25 | Q7.C 85.94,76.19 87.75,78 96,78 v97,79
N$26  (via drill 0.35 pad 0.55)
  Top 0.406: v95.5,90 v95.5,79.75 v95.5,70 v95.5,59.75 v95.5,49.75 v95.5,39.75 v95.5,29.75 v95.5,19.75 v95.5,9.75
  Bottom 0.305: U$2.P$124 106.69,90 v95.5,90 | U$2.P$140 106.56,79.75 v95.5,79.75 | U$2.P$60 95.56,69.94 v95.5,70 | U$2.P$76 95.57,59.82 v95.5,59.75 | U$2.P$12 95.57,49.82 v95.5,49.75 | U$2.P$28 v95.51,39.76 v95.5,39.75 | U$2.P$108 95.56,9.7 v95.5,9.75 | U$2.P$44 v95.51,29.76 v95.5,29.75 | U$2.P$92 95.56,19.7 v95.5,19.75
  Bottom 0.61: Q8.C 83.87,85.12 88.75,90 v95.5,90
N$28  (via drill 0.35 pad 0.55)
  Top 0.406: v89.5,16.75 v89.5,26.5 v89.5,36.5 v89.5,46.5 v89.5,56.5 v89.5,66.5 v89.5,76.5 v89.5,86.5 v89.5,96.25
  Bottom 0.305: U$2.P$141 114.25,84.2 114.25,85 112.75,86.5 v89.5,86.5 | U$2.P$125 114.26,94.82 112.75,96.33 89.58,96.33 v89.5,96.25 | U$2.P$61 114.26,74.74 112.5,76.5 v89.5,76.5 | U$2.P$77 114.26,64.99 112.75,66.5 v89.5,66.5 | U$2.P$13 114.26,54.99 112.75,56.5 v89.5,56.5 | U$2.P$29 112.14,46.5 v89.5,46.5 | U$2.P$45 112.14,36.5 v89.5,36.5 | U$2.P$93 112.21,26.5 v89.5,26.5 | U$2.P$109 111.96,16.75 v89.5,16.75
  Bottom 0.61: v89.5,26.5 84.94,21.94 Q1.C